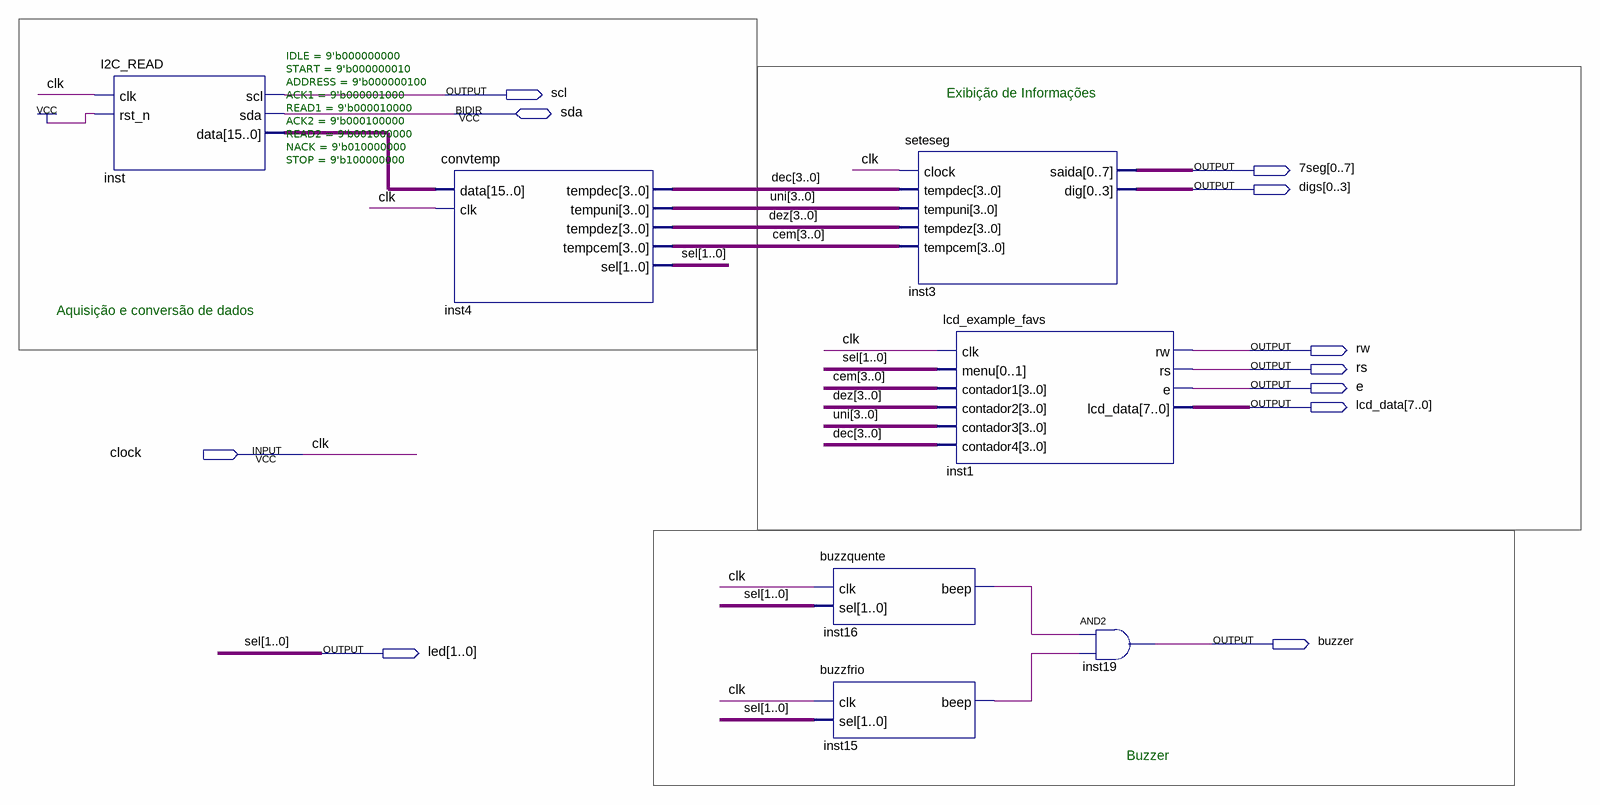
[diagram p0: schematic sheet]
// Quartus schematic teste.bdf as structural Verilog: 7 symbols, 11 pins
module teste (
  input  clock,
  inout  sda,
  output scl,
  output [0:7] \7seg ,
  output [0:3] digs,
  output rw,
  output rs,
  output e,
  output [7:0] lcd_data,
  output buzzer,
  output [1:0] led
);

  wire inst15_beep, inst16_beep;
  wire [3:0] cem, dec, dez, uni;
  wire [15:0] inst_data;

  I2C_READ #(.IDLE(9'b000000000), .START(9'b000000010), .ADDRESS(9'b000000100), .ACK1(9'b000001000), .READ1(9'b000010000), .ACK2(9'b000100000), .READ2(9'b001000000), .NACK(9'b010000000), .STOP(9'b100000000)) inst (
    .clk(clock), .rst_n(1'b1), .scl(scl), .data(inst_data), .sda(sda));
  convtemp inst4 (.data(inst_data), .clk(clock), .tempdec(dec), .tempuni(uni), .tempdez(dez), .tempcem(cem), .sel(led));
  buzzquente inst16 (.clk(clock), .sel(led), .beep(inst16_beep));
  buzzfrio inst15 (.clk(clock), .sel(led), .beep(inst15_beep));
  seteseg inst3 (.clock(clock), .tempdec(dec), .tempuni(uni), .tempdez(dez), .tempcem(cem), .saida(\7seg ), .dig(digs));
  lcd_example_favs inst1 (
    .clk(clock), .menu(led), .contador1(cem), .contador2(dez), .contador3(uni), .contador4(dec), .rw(rw),
    .rs(rs), .e(e), .lcd_data(lcd_data));
  and inst19 (buzzer, inst16_beep, inst15_beep);

  // Other names for the same wires on the sheet: clk = clock; sel[1:0] = led

  // Notes on the sheet:
  //   Exibição de Informações
  //   Aquisição e conversão de dados
  //   Buzzer
endmodule
